# EAGLE design 40 Pin Relocator (EAGLE 7.7.0)
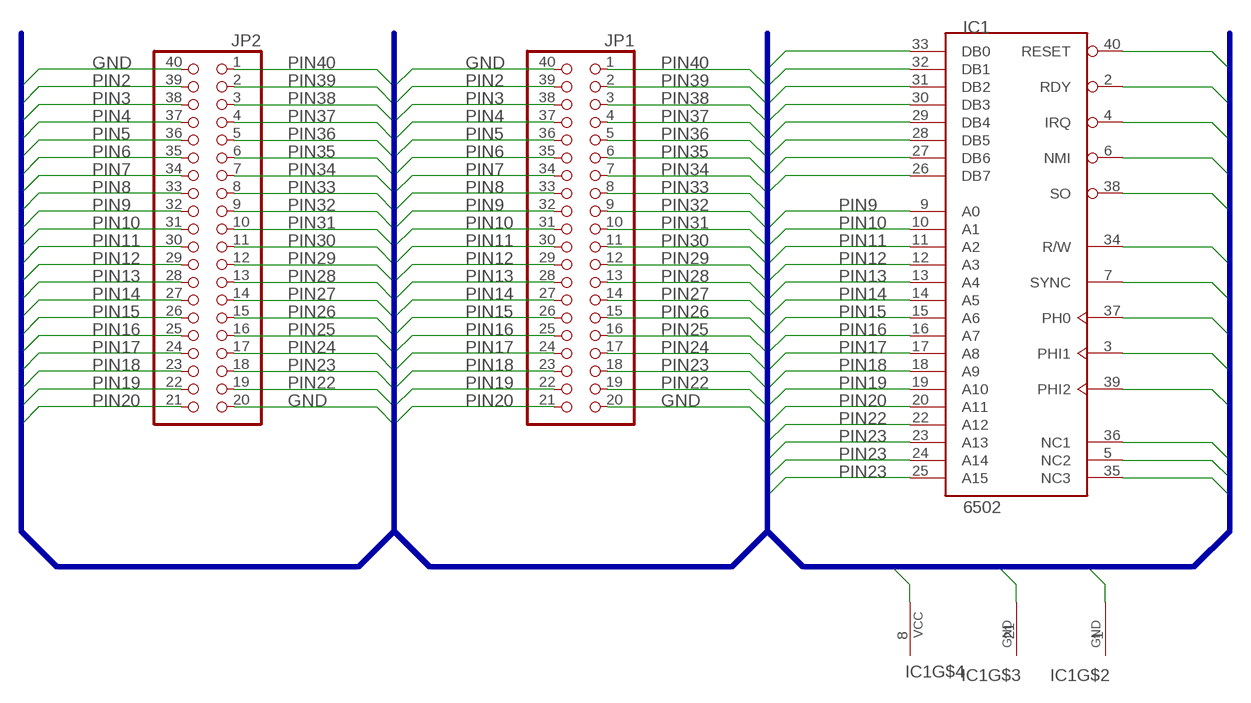
[diagram p0: schematic, sheet 1]

## Parts
IC1  6502  [DIP40]
JP1  PINHD-2X20  [2X20]
JP2  PINHD-2X20  [2X20]

## Nets
GND: IC1.1(GND) IC1.21(GND) JP1.20 JP1.40 JP2.20 JP2.40
PIN2: IC1.2(RDY) JP1.39 JP2.39
PIN3: IC1.3(PHI1) JP1.38 JP2.38
PIN4: IC1.4(IRQ) JP1.37 JP2.37
PIN5: IC1.5(NC2) JP1.36 JP2.36
PIN6: IC1.6(NMI) JP1.35 JP2.35
PIN7: IC1.7(SYNC) JP1.34 JP2.34
PIN8: IC1.8(VCC) JP1.33 JP2.33
PIN9: IC1.9(A0) JP1.32 JP2.32
PIN10: IC1.10(A1) JP1.31 JP2.31
PIN11: IC1.11(A2) JP1.30 JP2.30
PIN12: IC1.12(A3) JP1.29 JP2.29
PIN13: IC1.13(A4) JP1.28 JP2.28
PIN14: IC1.14(A5) JP1.27 JP2.27
PIN15: IC1.15(A6) JP1.26 JP2.26
PIN16: IC1.16(A7) JP1.25 JP2.25
PIN17: IC1.17(A8) JP1.24 JP2.24
PIN18: IC1.18(A9) JP1.23 JP2.23
PIN19: IC1.19(A10) JP1.22 JP2.22
PIN20: IC1.20(A11) JP1.21 JP2.21
PIN22: IC1.22(A12) JP1.19 JP2.19
PIN23: IC1.23(A13) JP1.18 JP2.18
PIN24: IC1.24(A14) JP1.17 JP2.17
PIN25: IC1.25(A15) JP1.16 JP2.16
PIN26: IC1.26(DB7) JP1.15 JP2.15
PIN27: IC1.27(DB6) JP1.14 JP2.14
PIN28: IC1.28(DB5) JP1.13 JP2.13
PIN29: IC1.29(DB4) JP1.12 JP2.12
PIN30: IC1.30(DB3) JP1.11 JP2.11
PIN31: IC1.31(DB2) JP1.10 JP2.10
PIN32: IC1.32(DB1) JP1.9 JP2.9
PIN33: IC1.33(DB0) JP1.8 JP2.8
PIN34: IC1.34(R/W) JP1.7 JP2.7
PIN35: IC1.35(NC3) JP1.6 JP2.6
PIN36: IC1.36(NC1) JP1.5 JP2.5
PIN37: IC1.37(PH0) JP1.4 JP2.4
PIN38: IC1.38(SO) JP1.3 JP2.3
PIN39: IC1.39(PHI2) JP1.2 JP2.2
PIN40: IC1.40(RESET) JP1.1 JP2.1

## Buses
PIN[1..40]

## Library data of the parts
IC1 = 0RB_65xx:6502
JP1 JP2 = pinhead:PINHD-2X20: PIN HEADER

## Net classes
0 default: clearance 0.205 mm

## Board
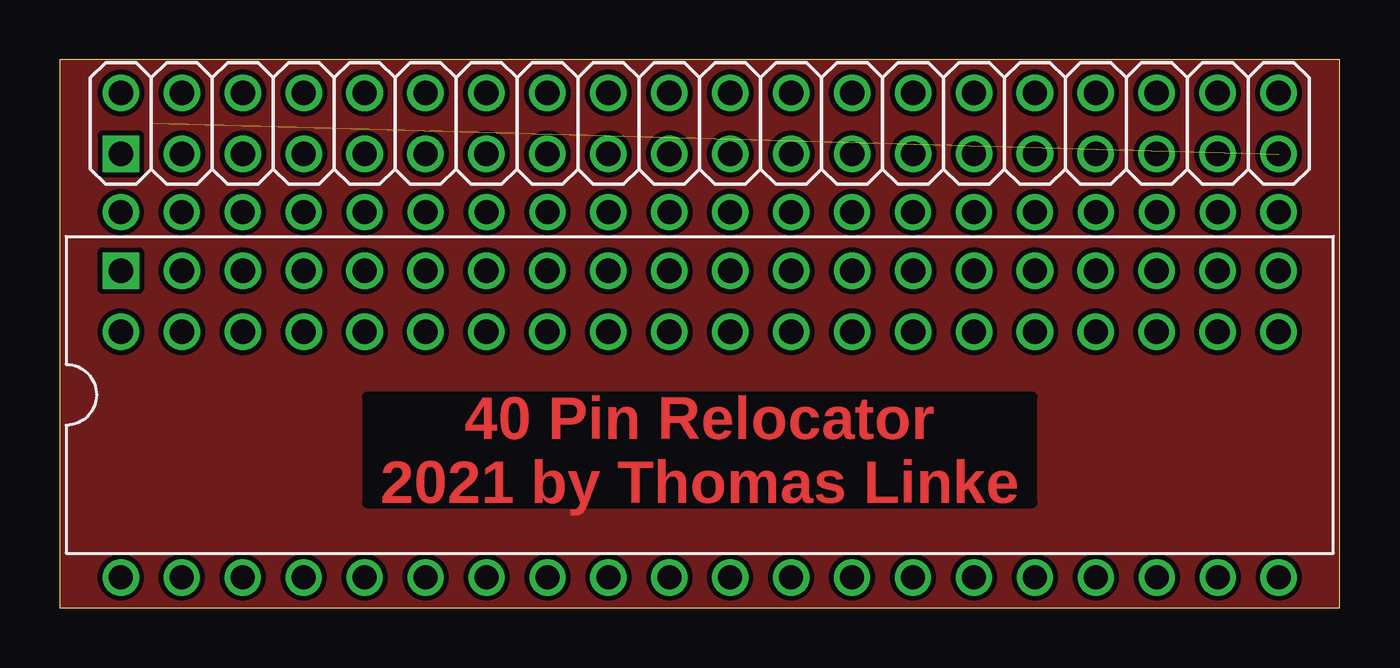
[diagram p1: board, top side]
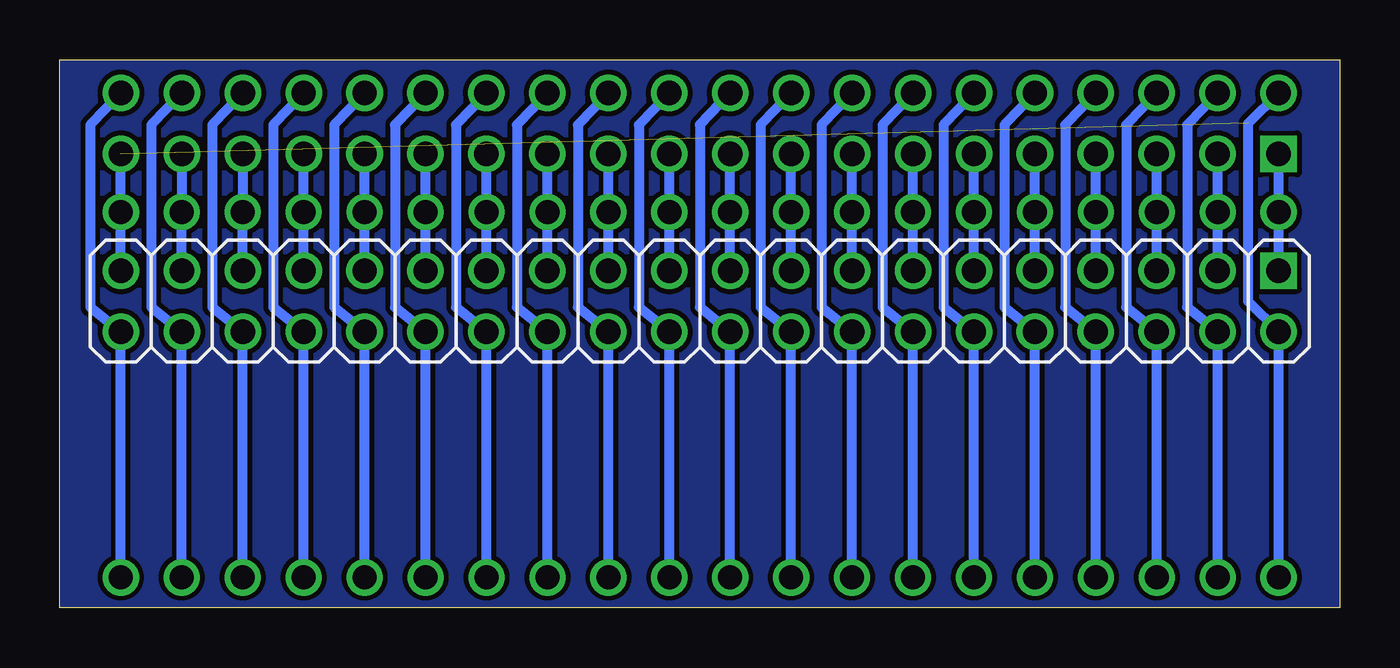
[diagram p2: board, bottom side, seen from below]

Size 53.34 x 22.85 mm. Coordinates in mm from the lower left corner, seen from the top.
Outline: 53.34,0 53.34,22.85 0,22.85 0,0 53.34,0
Copper layers (1*16): Top 0.035mm / dielectric 1.5mm / Bottom 0.035mm
Design rules "default *": minimum track width 10mil, minimum drill 24mil, track to track 6mil, track to pad 6mil, pad to pad 6mil, via to via 6mil, smd to smd 6mil, copper to edge 0.01mm, drill to drill 8mil, minimum pad ring 10mil, minimum via ring 8mil, stop-mask expansion 4mil, vias tented up to drill 0mil, thermal gap 10mil

### Footprints (pad centres in the part's own frame; a part is rotated, then mirrored left to right if it is on the bottom)
DIP40 = drill 1: 1 -24.13,-7.62; 2 -21.59,-7.62; 3 -19.05,-7.62; 4 -16.51,-7.62; 5 -13.97,-7.62; 6 -11.43,-7.62; 7 -8.89,-7.62; 8 -6.35,-7.62; 9 -3.81,-7.62; 10 -1.27,-7.62; 11 1.27,-7.62; 12 3.81,-7.62; 13 6.35,-7.62; 14 8.89,-7.62; 15 11.43,-7.62; 16 13.97,-7.62; 17 16.51,-7.62; 18 19.05,-7.62; 19 21.59,-7.62; 20 24.13,-7.62; 21 24.13,7.62; 22 21.59,7.62; 23 19.05,7.62; 24 16.51,7.62; 25 13.97,7.62; 26 11.43,7.62; 27 8.89,7.62; 28 6.35,7.62; 29 3.81,7.62; 30 1.27,7.62; 31 -1.27,7.62; 32 -3.81,7.62; 33 -6.35,7.62; 34 -8.89,7.62; 35 -11.43,7.62; 36 -13.97,7.62; 37 -16.51,7.62; 38 -19.05,7.62; 39 -21.59,7.62; 40 -24.13,7.62
2X20 = drill 1.016 square: 1 -24.13,-1.27 | drill 1.016: 2 -21.59,-1.27; 3 -19.05,-1.27; 4 -16.51,-1.27; 5 -13.97,-1.27; 6 -11.43,-1.27; 7 -8.89,-1.27; 8 -6.35,-1.27; 9 -3.81,-1.27; 10 -1.27,-1.27; 11 1.27,-1.27; 12 3.81,-1.27; 13 6.35,-1.27; 14 8.89,-1.27; 15 11.43,-1.27; 16 13.97,-1.27; 17 16.51,-1.27; 18 19.05,-1.27; 19 21.59,-1.27; 20 24.13,-1.27; 21 24.13,1.27; 22 21.59,1.27; 23 19.05,1.27; 24 16.51,1.27; 25 13.97,1.27; 26 11.43,1.27; 27 8.89,1.27; 28 6.35,1.27; 29 3.81,1.27; 30 1.27,1.27; 31 -1.27,1.27; 32 -3.81,1.27; 33 -6.35,1.27; 34 -8.89,1.27; 35 -11.43,1.27; 36 -13.97,1.27; 37 -16.51,1.27; 38 -19.05,1.27; 39 -21.59,1.27; 40 -24.13,1.27

### Placement (x,y rotation side)
IC1  26.67,8.88 0 top
JP1  26.67,20.2 0 top
JP2  26.67,12.79 180 bottom

### Tracks (layer width: path | path; a pad name or v marks a point on that pad's centre or on a via)
GND  (1 unrouted)
  Bottom 0.406: IC1.1 JP2.40 3.8,12.78 3.8,20.21 JP1.40 | JP2.20 IC1.21 JP1.20
PIN2
  Bottom 0.406: JP1.39 6.35,20.15 6.35,12.53 JP2.39 IC1.2
PIN3
  Bottom 0.406: JP1.38 8.89,20.15 8.89,12.53 JP2.38 IC1.3
PIN4
  Bottom 0.406: JP1.37 11.43,20.15 11.43,12.53 JP2.37 IC1.4
PIN5
  Bottom 0.406: JP1.36 13.97,20.15 13.97,12.53 JP2.36 IC1.5
PIN6
  Bottom 0.406: JP1.35 16.51,20.15 16.51,12.53 JP2.35 IC1.6
PIN7
  Bottom 0.406: JP1.34 19.05,20.15 19.05,12.53 JP2.34 IC1.7
PIN8
  Bottom 0.406: JP1.33 21.59,20.15 21.59,12.53 JP2.33 IC1.8
PIN9
  Bottom 0.406: JP1.32 24.13,20.15 24.13,12.53 JP2.32 IC1.9
PIN10
  Bottom 0.406: JP1.31 26.67,20.15 26.67,12.53 JP2.31 IC1.10
PIN11
  Bottom 0.406: JP1.30 29.21,20.15 29.21,12.53 JP2.30 IC1.11
PIN12
  Bottom 0.406: JP1.29 31.75,20.15 31.75,12.53 JP2.29 IC1.12
PIN13
  Bottom 0.406: JP1.28 34.29,20.15 34.29,12.53 JP2.28 IC1.13
PIN14
  Bottom 0.406: JP1.27 36.83,20.15 36.83,12.53 JP2.27 IC1.14
PIN15
  Bottom 0.406: JP1.26 39.37,20.15 39.37,12.53 JP2.26 IC1.15
PIN16
  Bottom 0.406: JP1.25 41.91,20.15 41.91,12.53 JP2.25 IC1.16
PIN17
  Bottom 0.406: JP1.24 44.45,20.15 44.45,12.53 JP2.24 IC1.17
PIN18
  Bottom 0.406: JP1.23 46.99,20.15 46.99,12.53 JP2.23 IC1.18
PIN19
  Bottom 0.406: JP1.22 49.53,20.15 49.53,12.53 JP2.22 IC1.19
PIN20
  Bottom 0.406: JP1.21 52.07,20.15 52.07,12.53 JP2.21 IC1.20
PIN22
  Bottom 0.406: JP2.19 IC1.22 JP1.19
PIN23
  Bottom 0.406: JP2.18 IC1.23 JP1.18
PIN24
  Bottom 0.406: JP2.17 IC1.24 JP1.17
PIN25
  Bottom 0.406: JP2.16 IC1.25 JP1.16
PIN26
  Bottom 0.406: JP2.15 IC1.26 JP1.15
PIN27
  Bottom 0.406: JP2.14 IC1.27 JP1.14
PIN28
  Bottom 0.406: JP2.13 IC1.28 JP1.13
PIN29
  Bottom 0.406: JP2.12 IC1.29 JP1.12
PIN30
  Bottom 0.406: JP2.11 IC1.30 JP1.11
PIN31
  Bottom 0.406: JP2.10 IC1.31 JP1.10
PIN32
  Bottom 0.406: JP2.9 IC1.32 JP1.9
PIN33
  Bottom 0.406: JP2.8 IC1.33 JP1.8
PIN34
  Bottom 0.406: JP2.7 IC1.34 JP1.7
PIN35
  Bottom 0.406: JP2.6 IC1.35 JP1.6
PIN36
  Bottom 0.406: JP2.5 IC1.36 JP1.5
PIN37
  Bottom 0.406: JP2.4 IC1.37 JP1.4
PIN38
  Bottom 0.406: JP2.3 IC1.38 JP1.3
PIN39
  Bottom 0.406: JP2.2 IC1.39 JP1.2
PIN40
  Bottom 0.406: JP2.1 IC1.40 JP1.1
PLATE
  pour Bottom (isolate 0): 53.34,0.15 53.34,22.85 0,22.85 0,0.15
  pour Top (isolate 0): 53.34,0.15 53.34,22.85 0,22.85 0,0.15

### Text on the board
Top: 40 Pin Relocator / 2021 by Thomas Linke